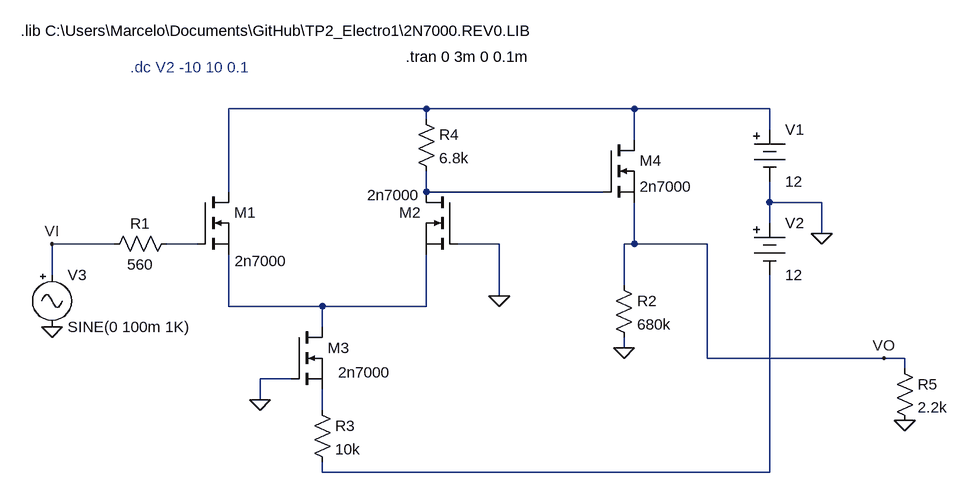
[diagram p0: schematic Amplif.asc]
Amplif.asc, the LTspice schematic file:
Version 4
SHEET 1 1592 680
WIRE 512 -144 208 -144
WIRE 832 -144 512 -144
WIRE 1040 -144 832 -144
WIRE 512 -128 512 -144
WIRE 1040 -112 1040 -144
WIRE 832 -96 832 -144
WIRE 208 -16 208 -144
WIRE 512 -16 512 -48
WIRE 784 -16 512 -16
WIRE 1040 0 1040 -32
WIRE 1120 0 1040 0
WIRE 1040 32 1040 0
WIRE 1120 48 1120 0
WIRE 32 64 -64 64
WIRE 160 64 112 64
WIRE 624 64 560 64
WIRE 832 64 832 0
WIRE 832 64 816 64
WIRE 944 64 832 64
WIRE -64 112 -64 64
WIRE 816 128 816 64
WIRE 624 144 624 64
WIRE 208 160 208 80
WIRE 352 160 208 160
WIRE 512 160 512 80
WIRE 512 160 352 160
WIRE 352 192 352 160
WIRE 816 224 816 208
WIRE 944 240 944 64
WIRE 1216 240 944 240
WIRE 1248 240 1216 240
WIRE 1248 256 1248 240
WIRE 304 272 256 272
WIRE 256 304 256 272
WIRE 352 320 352 288
WIRE 352 416 352 400
WIRE 1040 416 1040 112
WIRE 1040 416 352 416
FLAG 624 144 0
FLAG 1120 48 0
FLAG 256 304 0
FLAG -64 192 0
FLAG 816 224 0
FLAG 1216 240 VO
FLAG -64 64 VI
FLAG 1248 336 0
SYMBOL nmos 160 -16 R0
WINDOW 3 57 106 Left 2
SYMATTR Value 2n7000
SYMATTR InstName M1
SYMATTR Prefix X
SYMBOL nmos 560 -16 M0
WINDOW 3 58 5 Left 2
SYMATTR Value 2n7000
SYMATTR InstName M2
SYMATTR Prefix X
SYMBOL nmos 304 192 R0
WINDOW 3 72 70 Left 2
SYMATTR Value 2n7000
SYMATTR InstName M3
SYMATTR Prefix X
SYMBOL res 496 -144 R0
SYMATTR InstName R4
SYMATTR Value 6.8k
SYMBOL Misc\\battery 1040 -128 R0
WINDOW 123 0 0 Left 2
WINDOW 39 0 0 Left 2
SYMATTR InstName V1
SYMATTR Value 12
SYMBOL nmos 784 -96 R0
SYMATTR InstName M4
SYMATTR Value 2n7000
SYMATTR Prefix X
SYMBOL res 336 304 R0
SYMATTR InstName R3
SYMATTR Value 10k
SYMBOL Misc\\battery 1040 16 R0
WINDOW 123 0 0 Left 2
WINDOW 39 0 0 Left 2
SYMATTR InstName V2
SYMATTR Value 12
SYMBOL res 800 112 R0
SYMATTR InstName R2
SYMATTR Value 680k
SYMBOL res 128 48 R90
WINDOW 0 0 56 VBottom 2
WINDOW 3 32 56 VTop 2
SYMATTR InstName R1
SYMATTR Value 560
SYMBOL res 1232 240 R0
SYMATTR InstName R5
SYMATTR Value 2.2k
SYMBOL Misc\\signal -64 96 R0
WINDOW 123 0 0 Left 2
WINDOW 39 0 0 Left 2
SYMATTR InstName V3
SYMATTR Value SINE(0 100m 1K)
TEXT -112 -264 Left 2 !.lib C:\\Users\\Marcelo\\Documents\\GitHub\\TP2_Electro1\\2N7000.REV0.LIB
TEXT 56 -208 Left 2 ;.dc V2 -10 10 0.1
TEXT 480 -224 Left 2 !.tran 0 3m 0 0.1m

The netlist it stands for:
* Amplif.asc
XM1 N001 N003 N004 2n7000  ; pins D G S
XM2 N002 0 N004 2n7000  ; pins D G S
XM3 N004 0 N005 2n7000  ; pins D G S
R4 N001 N002 6.8k
V1 N001 0 12
XM4 N001 N002 VO 2n7000  ; pins D G S
R3 N005 N006 10k
V2 0 N006 12
R2 VO 0 680k
R1 N003 VI 560
R5 VO 0 2.2k
V3 VI 0 SINE(0 100m 1K)
.lib C:\Users\Marcelo\Documents\GitHub\TP2_Electro1\2N7000.REV0.LIB
* .dc V2 -10 10 0.1
.tran 0 3m 0 0.1m
.backanno
.end